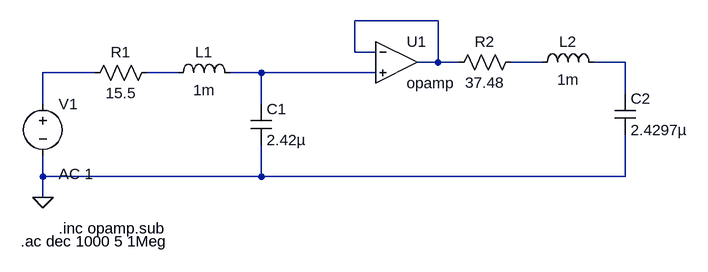
[diagram p0: schematic filtro_ord4.asc]
filtro_ord4.asc, the LTspice schematic file:
Version 4
SHEET 1 1004 680
WIRE 608 -16 480 -16
WIRE 480 32 480 -16
WIRE 512 32 480 32
WIRE 608 48 608 -16
WIRE 608 48 576 48
WIRE 640 48 608 48
WIRE 768 48 720 48
WIRE 896 48 848 48
WIRE 80 64 0 64
WIRE 208 64 160 64
WIRE 336 64 288 64
WIRE 512 64 336 64
WIRE 896 96 896 48
WIRE 0 112 0 64
WIRE 336 112 336 64
WIRE 0 224 0 192
WIRE 336 224 336 176
WIRE 336 224 0 224
WIRE 896 224 896 160
WIRE 896 224 336 224
WIRE 0 256 0 224
FLAG 0 256 0
SYMBOL voltage 0 96 R0
WINDOW 123 24 124 Left 2
WINDOW 39 0 0 Left 0
SYMATTR InstName V1
SYMATTR Value ""
SYMATTR Value2 AC 1
SYMBOL res 176 48 R90
WINDOW 0 0 56 VBottom 2
WINDOW 3 32 56 VTop 2
SYMATTR InstName R1
SYMATTR Value 15.5
SYMBOL ind 192 80 R270
WINDOW 0 32 56 VTop 2
WINDOW 3 5 56 VBottom 2
SYMATTR InstName L1
SYMATTR Value 1m
SYMBOL cap 320 112 R0
SYMATTR InstName C1
SYMATTR Value 2.42µ
SYMBOL OpAmps\\opamp 544 -16 R0
SYMATTR InstName U1
SYMBOL res 736 32 R90
WINDOW 0 0 56 VBottom 2
WINDOW 3 32 56 VTop 2
SYMATTR InstName R2
SYMATTR Value 37.48
SYMBOL ind 752 64 R270
WINDOW 0 32 56 VTop 2
WINDOW 3 5 56 VBottom 2
SYMATTR InstName L2
SYMATTR Value 1m
SYMBOL cap 880 96 R0
SYMATTR InstName C2
SYMATTR Value 2.4297µ
TEXT 24 304 Left 2 !.inc opamp.sub
TEXT -34 324 Left 2 !.ac dec 1000 5 1Meg

The netlist it stands for:
* filtro_ord4.asc
V1 N004 0 AC 1
R1 N005 N004 15.5
L1 N005 N006 1m
C1 N006 0 2.42µ
XU1 N001 N006 N001 opamp Aol=100K GBW=10Meg  ; pins invin noninvin out
R2 N002 N001 37.48
L2 N002 N003 1m
C2 N003 0 2.4297µ
.inc opamp.sub
.ac dec 1000 5 1Meg
.backanno
.end